# EAGLE design afb_r005_revc (EAGLE 9.6.2)
AUTHOR: Wes B; REV: 3R1

## Sheet 1 of 2
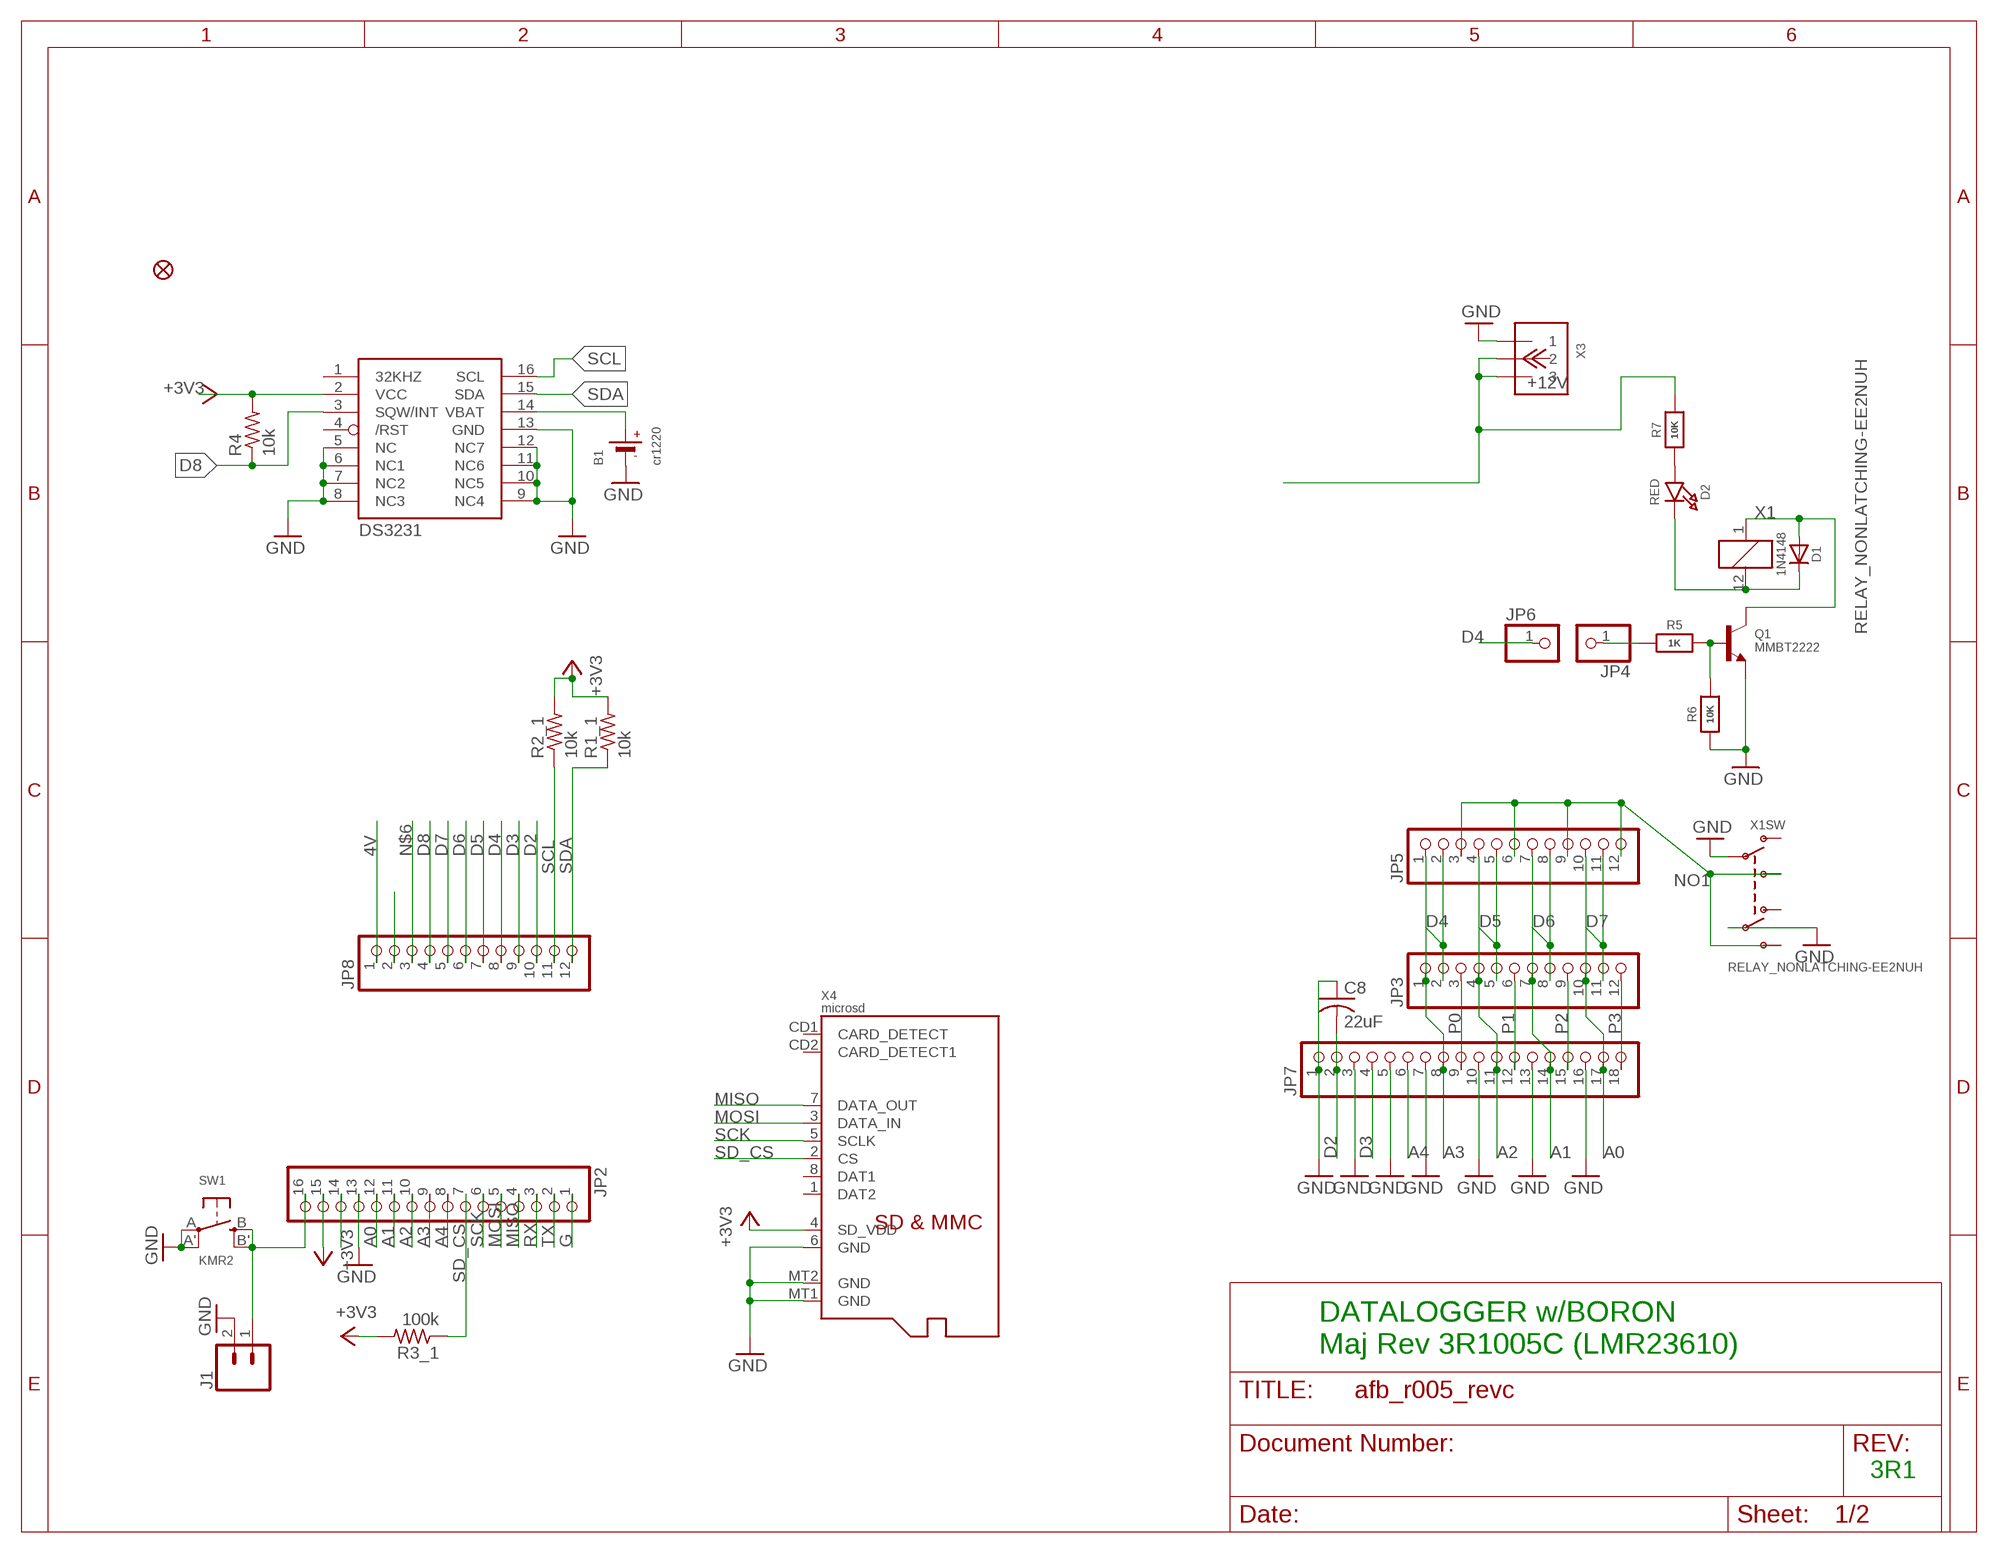
[diagram p0: schematic, sheet 1]

### Parts
B1  cr1220  BATTERYCR1220_2  [CR1220-2]
C8  22uF  C-USC0805  [C0805]
D1  1N4148  DIODESOD-323  [SOD-323]
D2  RED  LED0805_NOOUTLINE  [CHIPLED_0805_NOOUTLINE]
FID1  FIDUCIAL_1MM  [FIDUCIAL_1MM]
IC2  DS3231/SO  [SO16W]
J1  CONN_02  [1X02]
JP2  HEADER-1X16ROUND  [1X16_ROUND]
JP3  PINHD-1X12-CB  [1X12-CB]
JP4  HEADER-1X1ROUND  [1X01_ROUND]
JP5  PINHD-1X12-CB  [1X12-CB]
JP6  HEADER-1X1ROUND  [1X01_ROUND]
JP7  PINHD-1X18  [1X18]
JP8  PINHD-1X12-CB  [1X12-CB]
Q1  MMBT2222  TRANSISTOR_NPN  [SOT23-R]
R1_1  10k  R-US_R0805  [R0805]
R2_1  10k  R-US_R0805  [R0805]
R3_1  100k  R-US_R0805  [R0805]
R4  10k  R-US_R0805  [R0805]
R5  1K  RESISTOR0805_NOOUTLINE  [0805-NO]
R6  10K  RESISTOR0805_NOOUTLINE  [0805-NO]
R7  10K  RESISTOR0805_NOOUTLINE  [0805-NO]
SW1  KMR2  SWITCH_TACT_SMT4.6X2.8  [BTN_KMR2_4.6X2.8]
X1  RELAY_NONLATCHING-EE2NUH  [RELAY_EE2_NOLATCH]
X3  TERMBLOCK_1X3  [TERMBLOCK_1X3-3.5MM]
X4  microsd  MICROSD  [MICROSD]

### Nets
4V: JP8.1 ; also sheet 2
+3V3: IC2.2(VCC) JP2.15 R1_1.2 R2_1.2 R3_1.2 R4.2 X4.4(SD_VDD)
A0: JP2.12 JP3.10 JP5.10 JP7.17
A1: JP2.11 JP3.7 JP5.7 JP7.14
A2: JP2.10 JP3.4 JP5.4 JP7.11
A3: JP2.9 JP3.1 JP5.1 JP7.8
A4: JP2.8 JP7.6
AREF: JP2.14
D2: C8.2 JP7.2 JP8.10
D3: JP7.4 JP8.9
D4: JP3.2 JP5.2 JP6.1 JP8.8
D5: JP3.5 JP5.5 JP8.7
D6: JP3.8 JP5.8 JP8.6
D7: JP3.11 JP5.11 JP8.5
D8: IC2.3(SQW/INT) JP8.4 R4.1
G: JP2.1
GND: B1.- C8.1 IC2.5(NC) IC2.6(NC1) IC2.7(NC2) IC2.8(NC3) IC2.9(NC4) IC2.10(NC5) IC2.11(NC6) IC2.12(NC7) IC2.13(GND) J1.2 JP2.13 JP7.1 JP7.3 JP7.5 JP7.7 JP7.10 JP7.13 JP7.16 Q1.2(E) R6.1 SW1.A'(P1) SW1.A(P) X1.4(SW:P2) X1.9(SW:P1) X3.1 X4.6(GND) X4.MT1(GND) X4.MT2(GND) ; also sheet 2
MISO: JP2.4 X4.7(DATA_OUT)
MOSI: JP2.5 X4.3(DATA_IN)
N$1: B1.+ IC2.14(VBAT)
N$2: D1.A Q1.3(C) X1.1
N$6: JP8.3
N$7: JP8.2
N$11: D1.C D2.C X1.12
N$22: Q1.1(B) R5.2 R6.2
N$24: JP4.1 R5.1
N$26: D2.A R7.1
NO1 [HV]: JP5.3 JP5.6 JP5.9 JP5.12 X1.5(SW:S2) X1.8(SW:S1)
P0: JP3.3 JP7.9
P1: JP3.6 JP7.12
P2: JP3.9 JP7.15
P3: JP3.12 JP7.18
RESET: J1.1 JP2.16 SW1.B'(S1) SW1.B(S)
RX: JP2.3
SCK: JP2.6 X4.5(SCLK)
SCL: IC2.16(SCL) JP8.11 R2_1.1
SD_CS: JP2.7 R3_1.1 X4.2(CS)
SDA: IC2.15(SDA) JP8.12 R1_1.1
TX: JP2.2
VIN: R7.2 X3.2 X3.3 ; also sheet 2
Unconnected: IC2.1(32KHZ) IC2.4(/RST) X1.3(SW:O2) X1.10(SW:O1) X4.1(DAT2) X4.8(DAT1) X4.CD1(CARD_DETECT) X4.CD2(CARD_DETECT1)

### Notes on the sheet
- DATALOGGER w/BORON
  Maj Rev 3R1005C (LMR23610)
- 3R1

## Sheet 2 of 2
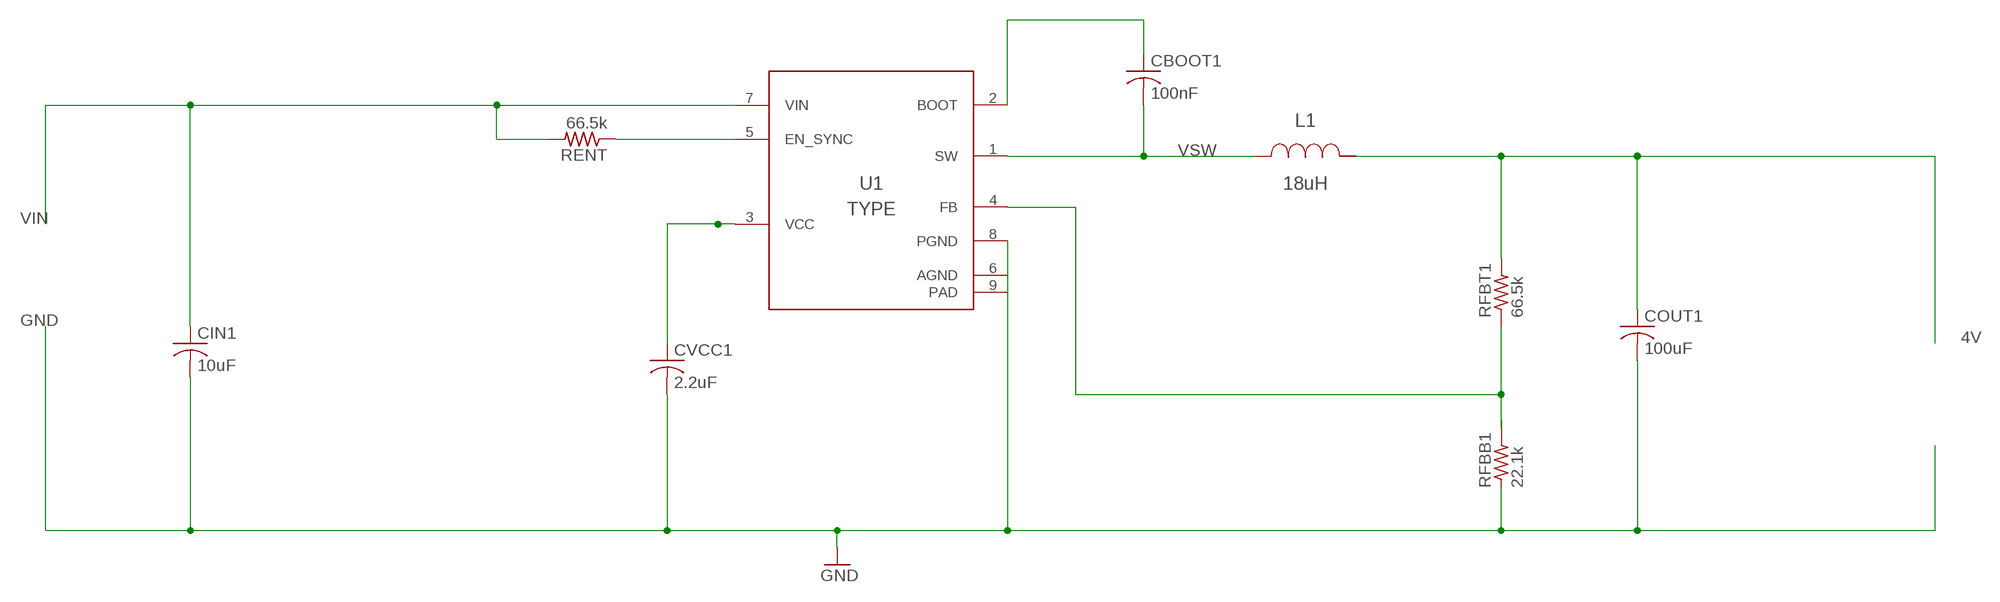
[diagram p1: schematic, sheet 2]

### Parts
CBOOT1  100nF  C-USC0805  [C0805]
CIN1  10uF  C-USC0805  [C0805]
COUT1  100uF  C-USC3216  [C3216]
CVCC1  2.2uF  C-USC0805  [C0805]
L1  18uH  NPI54C180MTRF  [IND_NPI54C]
RENT  66.5k  R-US_R0805  [R0805]
RFBB1  22.1k  R-US_R0805  [R0805]
RFBT1  66.5k  R-US_R0805  [R0805]
U1  Value  LMR23610ADDAR  [DDA0008E_N]

### Nets
3: CVCC1.1 U1.3(VCC)
4: CBOOT1.1 U1.2(BOOT)
4V: COUT1.1 L1.2 RFBT1.2 ; also sheet 1
FB: RFBB1.2 RFBT1.1 U1.4(FB)
GND: CIN1.2 COUT1.2 CVCC1.2 RFBB1.1 U1.6(AGND) U1.8(PGND) U1.9(PAD) ; also sheet 1
N$5: RENT.1 U1.5(EN_SYNC)
VIN: CIN1.1 RENT.2 U1.7(VIN) ; also sheet 1
VSW: CBOOT1.2 L1.1 U1.1(SW)

## Library data of the parts
B1 = microbuilder:BATTERY: CR1220 SMT - Digikey: 3001K-ND CD2032 BAT-HLD-001 - Digikey: BAT-HLD-001-ND
C8 CBOOT1 CIN1 COUT1 CVCC1 = adafruit:C-US: CAPACITOR, American symbol
D1 = microbuilder:DIODE: Diode SMA Model Volts Amps Type Vf Ir Digikey # Notes SSA34-E3 40V 3A Schottky 480mV @ 3A 200uA @ 40V SSA34-E3/61TGITR-ND CDBA120-G 20V 1A Schottky 500mV @ 1A 500uA @ 20V 641-1014-6-ND REEL MBRA210 10V 2A Schottky 350mV @ 2A 700uA @ 10V MBRA210LT3 SOD-123 Model Volts Amps Type Vf Ir Order # Notes BAT54T1G 30V 200mA Schottky 800mV @ 200mA 2uA @ 25V BAT54T1GOSTR-ND B0530W 30V 500mA Schottky 430mV @ 500mA 130uA @ 30V B0530W-FDICT-ND REEL MBR120 20V 1A Schottky 340mV @ 1A MBR120VLSFT1GOSCT-ND SOD-323 Model Volts Amps Type Vf Ir Order # Notes PMEG2005EJ 20V 500mA Schottky 355mV @ 500mA 568-4110-1-ND ZLLS410 10V 570mA Schottky 380mV @ 570mA ZLLS410CT-ND 1N4148WS 75V 150mA Silicon/Simple 1V 1N4148WSFSCT-ND REEL SOD-523 Model Volts Amps Type Vf Ir Order # Notes BAT54XV2 30V 200mA Schottky 0.8V @ 100mA BAT54XV2CT-ND TB751S 30V 30mA Schottky RB751S-40TE61CT-ND SOT23-R/W (R = Solder Paste/Reflow Ovens, W = Hand-Soldering) Model Volts Amps Type Vf Ir Order # Notes BAT54FILM 40V 300mA Schottky 497-7162-1-ND POWERDI-5 Model Volts Amps Type Vf Ir Order # Notes PDS560 60V 5A Schottky 670mV @ 5A 150uA @ 60V PDS560DICT-ND
D2 = microbuilder:LED: LED 0603 - 0603 Surface Mount Package 2mA: Green LED - Low Power (3.9mcd, 2ma, 1.7Vf) - Digikey: 475-2709-2-ND Orange LED - Low Power (9.8mcd, 2ma, 1.8Vf) - Digikey: 475-1194-2-ND Red LED - Low Power (5mcd, 2ma, 1.8Vf) - Digikey: 475-1195-2-ND Yellow LED - Low Power (7mcd, 2ma, 1.8Vf) - Digikey: 475-1196-2-ND 5mA: Blue LED - Low Power (17mcd, 5ma, 2.9Vf) - Digikey: LNJ937W8CRACT-ND 0805 - 0805 Surface Mount Package 2mA: Red LED (8.8mcd, 2mA, 1.8Vf, Clear) - Low Power [Digikey: 475-2510-1-ND] Green LED (5mcd, 2mA, 1.8Vf, Clear) - Low Power [Digikey: 475-2730-1-ND] Yellow LED (11.3mcd, 2mA, 1.8Vf, Clear) - Low Power [Digikey: 475-2555-1-ND] 20mA: Red LED (104mcd, 20mA, Diffused) - LS R976 [Digikey: 475-1278-6-ND] Red LED (12mcd, 20mA, 2.0Vf, Clear) - APT2012EC [Digikey: 754-1128-1-ND] Green LED (15mcd, 20mA, 2.2Vf, Clear) - APT2012GC [Digikey: 754-1131-1-ND] Orange LED (160mcd, 20mA, 2.1Vf, Clear) - APT2012SECK [Digikey: 754-1130-1-ND] 1206 - 1206 Surface Mount Package Green LED (26mcd, 20mA, Diffused) - LG N971 [Digikey: 475-1407-6-ND] Red LED (15mcd, 20mA, Diffused) - LH N974 [Digikey: 475-1416-6-ND] Cree - Cree High-Power Surface Mount LEDs XPEBWT-L1-0000-00D50 - White 111lm 350mA 2.9Vf 6200K 110° XTEAWT-00-0000-00000LEE3 - White 114lm 350mA 2.85Vf 5000K 115° Everlight - Everlight 45-21 Series Surface Mount LEDs 45-21/QK2C-B2832AC2CB2/2T - Warm White 2000mcd 20mA 3.25Vf 3050K 120° 45-21/LK2C-B38452C4CB2/2T - Nuetral White 2000mcd 20mA 3.25Vf 4150K 120° 45-21/LK2C-B50634C6CB2/2T - Cold White 2200mcd 20mA 3.25Vf 5650K 120° PLCC2 Reverse Mount LS T77K-J1L2-1-0-2-R18-Z - Red 11.25mcd 2mA 1.8Vf 630nm 120° LO T77K-L1M2-24-Z - Orange 19.6mcd 2mA 1.8Vf 606nm 120° LY T77K-K2M1-26-Z - Yellow 15.7mcd 2mA 1.8Vf 587nm 120°
FID1 = microbuilder:FIDUCIAL: Fiducial Alignment Points Various fiducial points for machine vision alignment.; BOM: EXCLUDE
IC2 = DS3231:DS3231; AVAILABILITY: Unavailable; DESCRIPTION: Real Time Clock (RTC) IC Clock/Calendar I²C, 2-Wire Serial 16-SOIC (0.295, 7.50mm Width); MF: Maxim Integrated; MP: DS3231; PACKAGE: SOIC-16 Maxim Integrated; PRICE: None
J1 = SparkFun-Connectors:CONN_02: Multi connection point. Often used as Generic Header-pin footprint for 0.1 inch spaced/style header connections On any of the 0.1 inch spaced packages, you can populate with these: Break Away Headers - Straight <https://www.sparkfun.com/products/116> (PRT-00116) Break Away Male Headers - Right Angle <https://www.sparkfun.com/products/553> (PRT-00553) Female Headers <https://www.sparkfun.com/products/115> (PRT-00115) Break Away Headers - Machine Pin <https://www.sparkfun.com/products/117> (PRT-00117) Break Away Female Headers - Swiss Machine Pin <https://www.sparkfun.com/products/743> (PRT-00743) For SCREWTERMINALS and SPRING TERMINALS visit here: Screw Terimnals on SparkFun.com <https://www.sparkfun.com/search/results?term=Screw+Terminals> (5mm/3.5mm/2.54mm spacing) This device is also useful as a general connection point to wire up your design to another part of your project. Our various solder wires solder well into these plated through hole pads. Hook-Up Wire - Assortment (Stranded, 22 AWG) <https://www.sparkfun.com/products/11375> (PRT-11375) Hook-Up Wire - Assortment (Solid Core, 22 AWG) <https://www.sparkfun.com/products/11367> (PRT-11367) View the entire wire category on our website here <https://www.sparkfun.com/categories/141> Special notes: Molex polarized connector foot print use with: PRT-08233 with associated crimp pins and housings. 2.54_SCREWTERM for use with PRT-10571. 3.5mm Screw Terminal footprints for PRT-08084 5mm Screw Terminal footprints for use with PRT-08432
JP2 = microbuilder:HEADER-1X16: PIN HEADER
JP3 JP5 JP8 = adafruit:PINHD-1X12: PIN HEADER
JP4 JP6 = microbuilder:HEADER-1X1: PIN HEADER
JP7 = adafruit:PINHD-1X18: PIN HEADER
L1 = AcceleratedDesigns_Lib:NPI54C180MTRF; DCR: 0.15; IDC: 1.4; L: 1.8E5; MANUFACTURER_NAME: NIC Components; MANUFACTURER_PART_NUMBER: NPI54C180MTRF; VENDOR: NIC Components
Q1 = microbuilder:TRANSISTOR_NPN: NPN Transistor Transistor (NPN) 500mA 45V - BC817 [Digikey: 568-1631-1-ND] Transistor (NPN) 500mA 45V - BC817,215 [Mouser: 771-BC817-T/R] SOT23-R - SOT23 footprint optimised for use with solder paste and reflow ovens. SOT23-W - SOT23 footprint optimised for hand-soldering (larger pads).
R1_1 R2_1 R3_1 R4 RENT RFBB1 RFBT1 = adafruit:R-US_: RESISTOR, American symbol
R5-R7 = microbuilder:RESISTOR: Resistors For new designs, use the packages preceded by an '_' character since they are more reliable: The following footprints should be used on most boards: _0402 - Standard footprint for regular board layouts _0603 - Standard footprint for regular board layouts _0805 - Standard footprint for regular board layouts _1206 - Standard footprint for regular board layouts For extremely tight-pitch boards where space is at a premium, the following 'micro-pitch' footprints can be used (smaller pads, no silkscreen outline, etc.): _0402MP - Micro-pitch footprint for very dense/compact boards _0603MP - Micro-pitch footprint for very dense/compact boards _0805MP - Micro-pitch footprint for very dense/compact boards _1206MP - Micro-pitch footprint for very dense/compact boards
SW1 = microbuilder:SWITCH_TACT_SMT: SMT Tact Switches 6x6mm - Digikey: P12940SCT-ND KMR2 (4.6x2.8mm) - Digikey: 401-1426-1-ND EVQ-PQHB55 - Light Touch, 160GF (4.5x4.5mm) - Digikey: P8090SCT-ND KMT0 - KMT021 NGJ LHS (etc.) IP68/Waterproof - Digikey: CKN10289CT-ND
U1 = AcceleratedDesigns_Lib:LMR23610ADDAR; MANUFACTURER: Texas Instruments; MANUFACTURER_NAME: Texas Instruments; MANUFACTURER_PART_NUMBER: LMR23610ADDAR; PARTNUMBER: LMR23610ADDAR; REFDES: RefDes; TYPE: TYPE
X1 = microbuilder:RELAY_NONLATCHING
X3 = microbuilder:TERMBLOCK_1X3: 3.5mm Terminal block http://www.ladyada.net/library/pcb/eaglelibrary.html
X4 = microbuilder:MICROSD: MicroSD/Transflash Card Holder with SPI pinout 3M: 2908-05WB-MG 4UConnector: 19656 Footprint courtesy: Adafruit Industries

## Net classes
1 HV: width 0.406 mm, drill 0.381 mm, clearance 1.016 mm

## Board
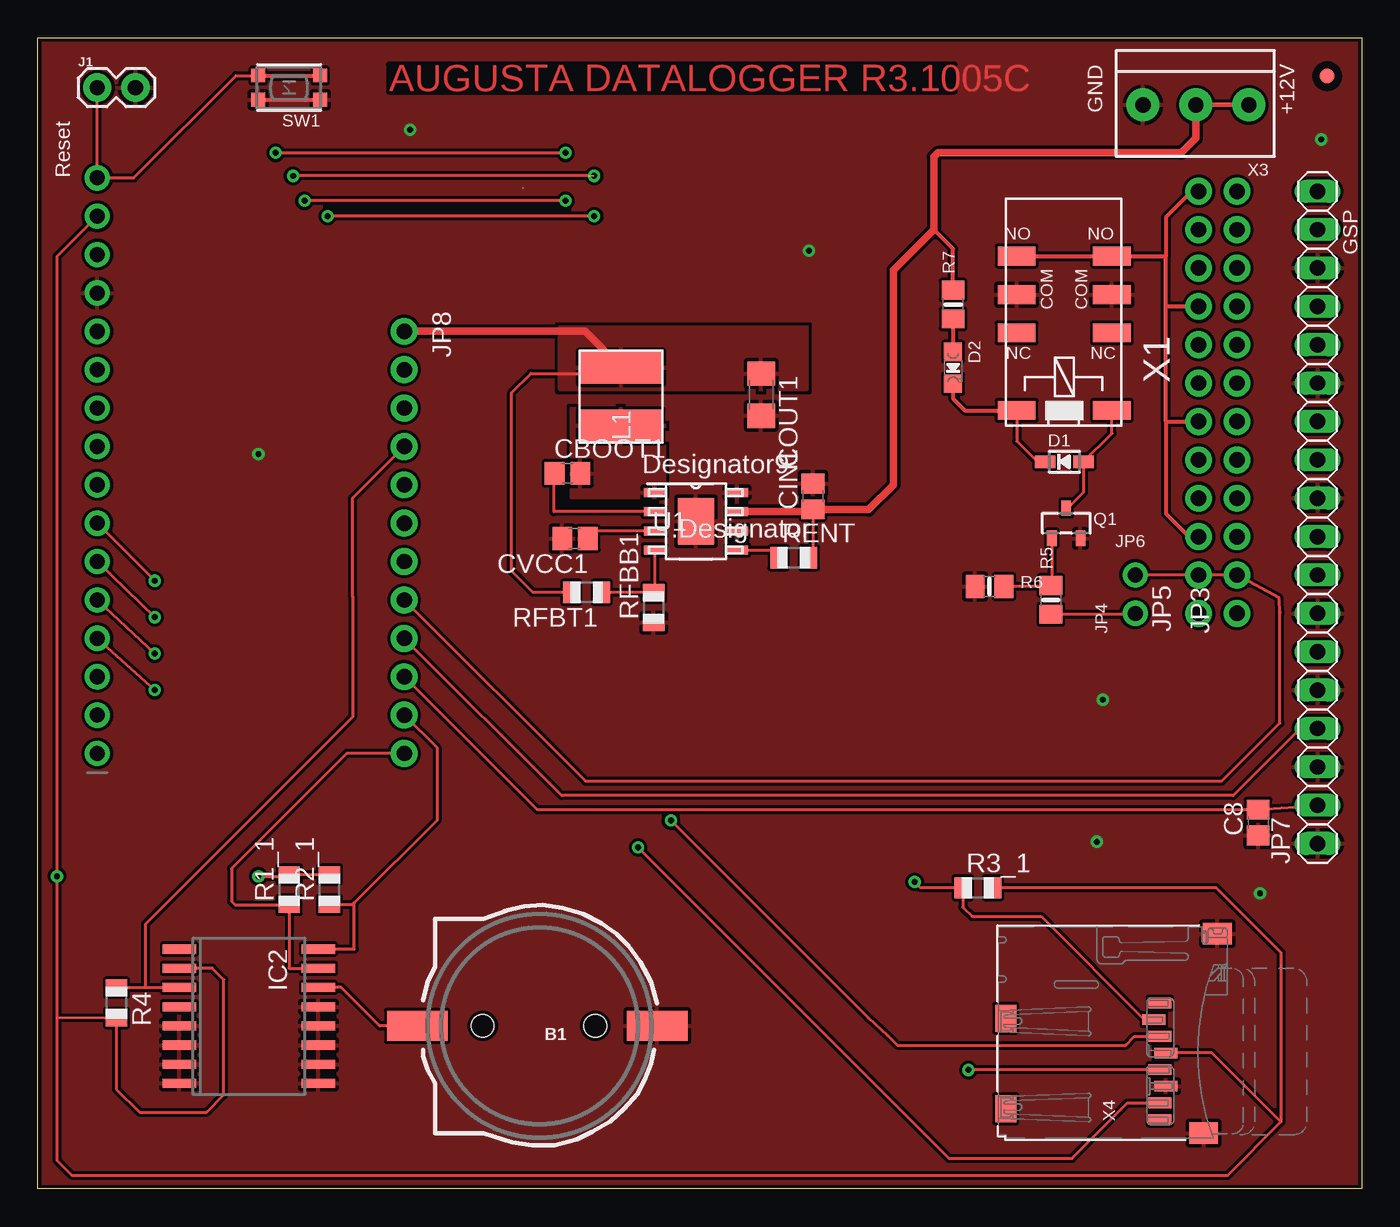
[diagram p2: board, top side]
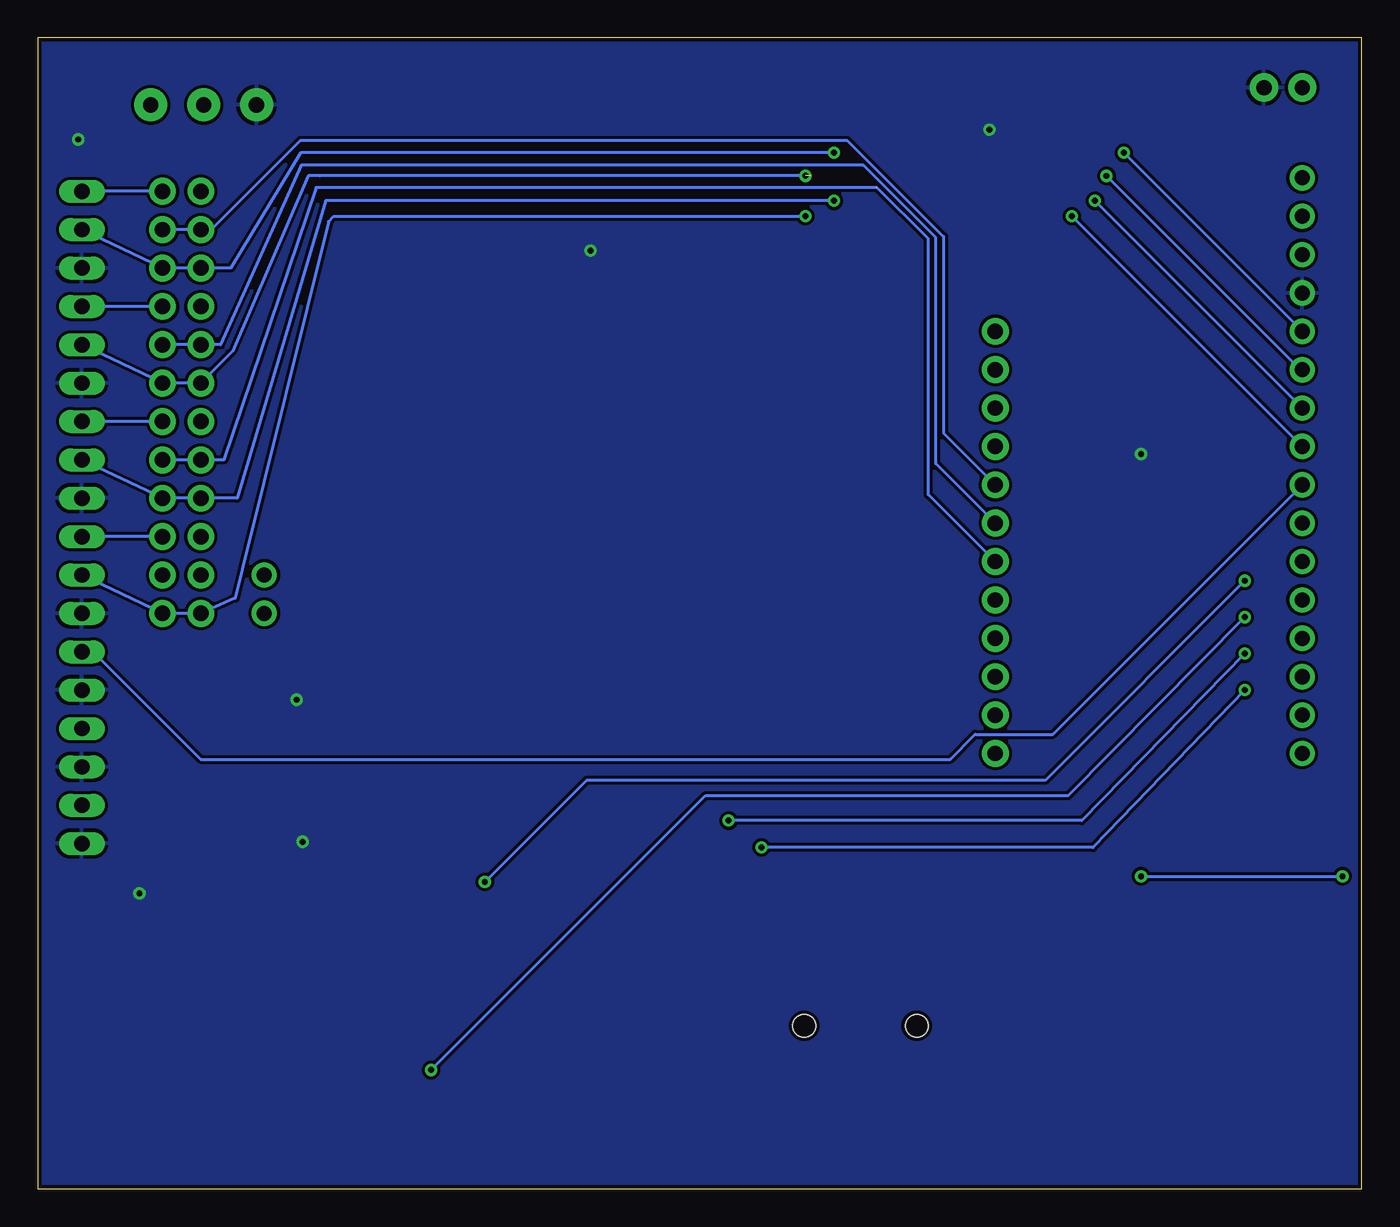
[diagram p3: board, bottom side, seen from below]

Size 87.63 x 76.2 mm. Coordinates in mm from the lower left corner, seen from the top.
Outline: 0,76.2 87.63,76.2 87.63,0 0,0 0,76.2
Copper layers (1*16): Top 0.035mm / dielectric 1.5mm / Bottom 0.035mm
Design rules "adafruit *": minimum track width 8mil, minimum drill 15.5mil, track to track 8mil, track to pad 8mil, pad to pad 8mil, via to via 8mil, smd to smd 8mil, copper to edge 10mil, drill to drill 8mil, minimum pad ring 10mil, minimum via ring 8mil, stop-mask expansion 2mil, vias tented up to drill 20mil, thermal gap 10mil

### Footprints (pad centres in the part's own frame; a part is rotated, then mirrored left to right if it is on the bottom)
CR1220-2 = smd 4 x 2: + 8.29,0; - -7.6,0 | hole 1.5: 3.95,0; -3.5,0
C0805 = smd 1.3 x 1.5: 1 -0.85,0; 2 0.85,0
C3216 = smd 1.6 x 1.8: 1 -1.4,0; 2 1.4,0
SOD-323 = smd 1.35 x 0.8: A 1.27,0; C -1.27,0
CHIPLED_0805_NOOUTLINE = smd 1.2 x 1.2: A 0,-1.05; C 0,1.05
FIDUCIAL_1MM = smd 1 x 1: 1 0,0
SO16W = smd 0.6 x 2.2: 1 -4.445,-4.6; 2 -3.175,-4.6; 3 -1.905,-4.6; 4 -0.635,-4.6; 5 0.635,-4.6; 6 1.905,-4.6; 7 3.175,-4.6; 8 4.445,-4.6; 9 4.445,4.6; 10 3.175,4.6; 11 1.905,4.6; 12 0.635,4.6; 13 -0.635,4.6; 14 -1.905,4.6; 15 -3.175,4.6; 16 -4.445,4.6
1X02 = drill 1.016 pad 1.88: 1 0,0; 2 2.54,0
1X16_ROUND = drill 1 pad 1.676: 1 -19.05,0; 2 -16.51,0; 3 -13.97,0; 4 -11.43,0; 5 -8.89,0; 6 -6.35,0; 7 -3.81,0; 8 -1.27,0; 9 1.27,0; 10 3.81,0; 11 6.35,0; 12 8.89,0; 13 11.43,0; 14 13.97,0; 15 16.51,0; 16 19.05,0
1X12-CB = drill 1.016 pad 1.778: 1 -13.97,0; 2 -11.43,0; 3 -8.89,0; 4 -6.35,0; 5 -3.81,0; 6 -1.27,0; 7 1.27,0; 8 3.81,0; 9 6.35,0; 10 8.89,0; 11 11.43,0; 12 13.97,0
1X01_ROUND = drill 1 pad 1.676: 1 0,0
1X18 = drill 1.016 long: 1 -21.59,0; 2 -19.05,0; 3 -16.51,0; 4 -13.97,0; 5 -11.43,0; 6 -8.89,0; 7 -6.35,0; 8 -3.81,0; 9 -1.27,0; 10 1.27,0; 11 3.81,0; 12 6.35,0; 13 8.89,0; 14 11.43,0; 15 13.97,0; 16 16.51,0; 17 19.05,0; 18 21.59,0
IND_NPI54C = smd 2.146 x 5.512: 1 -1.924,0; 2 1.924,0
SOT23-R = smd 0.635 x 1.016: 1 -0.95,-1; 2 0.95,-1; 3 0,1
R0805 = smd 1.1 x 1.4: 1 -1,0; 2 1,0
0805-NO = smd 1.24 x 1.5: 1 -0.95,0; 2 0.95,0
BTN_KMR2_4.6X2.8 = smd 0.9 x 0.9: A 2.05,0.8; A' -2.05,0.8; B 2.05,-0.8; B' -2.05,-0.8
DDA0008E_N = smd 1.45 x 0.6: 1 -2.725,1.905; 2 -2.725,0.635; 3 -2.725,-0.635; 4 -2.725,-1.905; 5 2.725,-1.905; 6 2.725,-0.635; 7 2.725,0.635; 8 2.725,1.905 | smd 2.4 x 3.1: 9 0,0
RELAY_EE2_NOLATCH = smd 1.25 x 2.5: 1 -6.5,-3.15; 3 -1.37,-3.15; 4 1.17,-3.15; 5 3.71,-3.15; 8 3.71,3.15; 9 1.17,3.15; 10 -1.37,3.15; 12 -6.5,3.15
TERMBLOCK_1X3-3.5MM = drill 1 pad 2.184: 1 3.55,0; 2 0.05,0; 3 -3.45,0
MICROSD = smd 0.7 x 1.5: 1 9,-10.64; 2 7.9,-10.24; 3 6.8,-10.64; 4 5.7,-11.04; 5 4.6,-10.64; 6 3.5,-11.04; 7 2.4,-10.64; 8 1.3,-10.64 | smd 1.8 x 1.4: CD1 2,-0.44; CD2 8,-0.44 | smd 1.4 x 1.9: MT1 0.4,-13.54; MT2 13.6,-14.44

### Placement (x,y rotation side)
B1  33.4,10.79 180 top
C8  80.77,24.26 90 top
CBOOT1  35.05,47.37 0 top
CIN1  51.31,45.85 90 top
COUT1  47.88,52.58 270 top
CVCC1  35.56,43.05 180 top
D1  67.94,48.13 0 top
D2  60.58,54.36 180 top
FID1  85.34,73.66 0 top
IC2  13.97,11.43 270 top
J1  3.94,72.9 0 top
JP2  3.94,47.88 90 top
JP3  79.38,52.07 90 top
JP4  72.64,38.1 90 top
JP5  76.83,52.07 90 top
JP6  72.64,40.64 0 top
JP7  84.71,44.45 90 top
JP8  24.26,42.8 270 top
L1  38.61,52.45 90 top
Q1  68.07,44.07 0 top
R1_1  16.64,19.81 90 top
R2_1  19.3,19.81 90 top
R3_1  62.23,19.94 0 top
R4  5.21,12.32 270 top
R5  67.06,38.99 90 top
R6  62.99,39.88 0 top
R7  60.58,58.55 90 top
RENT  50.04,41.78 0 top
RFBB1  40.77,38.48 90 top
RFBT1  36.32,39.5 180 top
SW1  16.64,72.9 180 top
U1  43.56,44.2 0 top
X1  67.94,58.04 90 top
X3  76.71,71.75 180 top
X4  63.63,3.3 90 top

### Tracks (layer width: path | path; a pad name or v marks a point on that pad's centre or on a via)
3
  Top 0.203: U1.3 36.92,43.56 CVCC1.1
4
  Top 0.203: U1.2 34.16,44.83 34.16,47.37 CBOOT1.1
4V
  Top 0.203: RFBT1.2 32.77,39.5 31.37,40.89 31.37,52.7 32.64,53.98 38.21,53.98 L1.2
  Top 0.508: JP8.1 36.21,56.77 L1.2
  pour Top (isolate 0.406): 34.54,52.96 50.93,52.96 50.93,57.02 34.54,57.02
+3V3  (via drill 0.39)
  Top 0.203: 1.27,11.3 v1.27,20.7 1.27,61.72 JP2.15 | 1.27,11.3 1.27,1.91 2.29,0.89 78.74,0.89 82.28,4.43 | X4.4 77.72,9 82.28,4.43 | 82.28,4.43 82.28,15.65 78,19.94 R3_1.2 | 1.27,11.3 R4.2 5.21,6.6 6.73,5.08 11.18,5.08 12.32,6.22 12.32,13.84 11.56,14.61 IC2.2 | v14.61,20.7 16.53,20.7 R1_1.2 R2_1.2
  Bottom 0.203: v14.61,20.7 v1.27,20.7
A0  (via drill 0.39)
  Top 0.203: v15.75,68.58 v34.92,68.58
  Bottom 0.203: JP7.17 JP3.10 JP5.10 74.85,60.96 70.23,68.58 v34.92,68.58 | JP2.12 v15.75,68.58
A1  (via drill 0.39)  (2 unrouted)
  Top 0.203: 36.45,67.06 v16.89,67.06
  Bottom 0.203: JP7.14 JP3.7 JP5.7 74.73,55.44 69.72,67.06 68.96,67.06 | v16.89,67.06 4.06,54.23 JP2.11 | v36.83,67.06 68.96,67.06 | 68.96,67.06
A2  (via drill 0.39)
  Top 0.203: v34.92,65.41 v17.65,65.41
  Bottom 0.203: v34.92,65.41 68.58,65.41 74.45,45.72 JP5.4 JP3.4 JP7.11 | JP2.10 v17.65,65.41
A3  (via drill 0.39)
  Top 0.203: v36.83,64.39 v19.18,64.39
  Bottom 0.203: JP2.9 v19.18,64.39 | JP7.8 JP3.1 JP5.1 74.55,39.12 74.09,41.01 68.39,64.04 68.04,64.39 v36.83,64.39
A4
  Bottom 0.203: JP7.6 83.95,35.56 76.83,28.45 27.24,28.45 25.59,30.1 20.45,30.1 JP2.8
D2
  Top 0.203: JP7.2 C8.2 33.06,25.11 JP8.10
D3
  Top 0.203: JP8.9 34.67,26.04 79.12,26.04 83.57,30.48 JP7.4
D4
  Top 0.203: 82.22,38.09 82.21,38.2 | 82.22,38.09 82.22,30.82 82.19,30.82 78.36,27 36.25,27 JP8.8 | 82.22,38.09 82.17,39.12 JP3.2 JP5.2 JP6.1
D5  (1 unrouted)
  Bottom 0.203: JP3.5 JP5.5 75.32,48.26 69.22,66.29 32.13,66.29 | JP8.7 28.69,45.97 28.69,62.9 32.09,66.29
D6
  Bottom 0.203: JP3.8 JP5.8 75.53,55.88 75.53,55.91 70.2,67.76 32.98,67.76 28.19,62.97 28.19,48 JP8.6
D7
  Bottom 0.203: JP3.11 JP5.11 76.15,63.5 70.24,69.41 34.06,69.41 27.68,63.04 27.68,50.04 JP8.5
D8
  Top 0.203: 9.35,13.35 IC2.3 7.11,13.34 | 7.11,13.34 5.21,13.34 R4.1 | JP8.4 20.83,45.72 20.83,39.24 20.83,31.24 7.11,17.53 7.11,13.34
FB
  Top 0.203: U1.4 40.84,39.55 RFBB1.2 37.34,39.48 RFBT1.1
GND  (via drill 0.39)
  Top 0.254: SW1.A SW1.A'
  other vias: 80.9,19.56 70.1,22.99 84.96,69.47 70.48,32.38 24.64,70.1 51.05,62.1 14.61,48.64
  pour Top (rank 3): 0,77.47 0,0 88.01,0 88.01,77.47
  pour Bottom: 0,77.47 0,0 88.14,0 88.14,77.47
MISO  (via drill 0.39)
  Top 0.203: 4.06,36.45 JP2.4 v7.75,33.02 | v39.73,22.61 60.31,2.03 68.45,2.03 72.12,5.7 X4.7
  Bottom 0.203: v39.73,22.61 17.78,22.61 v7.75,33.02
MOSI  (via drill 0.39)
  Top 0.203: 56.2,10.22 54.97,11.32 v41.9,24.38 | 56.2,10.22 56.26,10.16 | 56.2,10.22 56.89,9.53 72.01,9.53 72.59,10.1 X4.3 | JP2.5 v7.75,35.43
  Bottom 0.203: v7.75,35.43 18.54,24.38 v41.9,24.38
N$1
  Top 0.203: B1.+ 22.63,10.79 20.09,13.34 IC2.14
N$2
  Top 0.203: X1.1 71.09,50.01 D1.A 69.22,46.1 68.18,45.07 Q1.3
N$5
  Top 0.203: U1.5 48.53,42.29 RENT.1
N$11
  Top 0.203: X1.12 64.8,49.51 66.17,48.13 D1.C
  Top 0.254: D2.C 60.58,52.32 61.36,51.54 X1.12
N$22
  Top 0.203: Q1.1 67.12,40.01 R5.2 67,39.88 R6.2
N$24
  Top 0.203: JP4.1 72.58,38.04 R5.1
N$26
  Top 0.254: R7.1 D2.A
NO1
  Top 0.254: X1.8 X1.5 74.68,61.75 | 74.68,50.8 74.68,58.42 | 74.68,50.8 JP5.6 | 74.68,50.8 74.68,44.7 76.2,43.18 JP5.3 | 76.39,66.04 74.68,64.32 74.68,61.75 | 74.68,58.42 74.68,61.75 | JP5.9 74.68,58.42
  Top 0.406: JP5.12 76.39,66.04
P0
  Bottom 0.203: JP3.3 JP7.9
P1
  Bottom 0.203: JP3.6 JP7.12
P2
  Bottom 0.203: JP3.9 JP7.15
P3
  Bottom 0.203: JP3.12 JP7.18
RESET
  Top 0.203: SW1.B 13.12,73.7 6.35,66.93 JP2.16 J1.1
  Top 0.254: SW1.B SW1.B'
SCK  (via drill 0.39)
  Top 0.203: X4.5 74.24,7.87 v61.59,7.87 | JP2.6 v7.75,37.85
  Bottom 0.203: v7.75,37.85 19.43,26.04 43.43,26.04 v61.59,7.87
SCL
  Top 0.203: JP8.11 26.42,29.21 26.42,24.38 20.95,18.92 | IC2.16 20.95,15.88 20.95,18.92 | 20.95,18.92 20.84,18.81 R2_1.1
SD_CS  (via drill 0.39)
  Top 0.203: JP2.7 v7.75,40.26 | v58.04,20.32 58.42,19.94 R3_1.1 61.23,18.65 61.85,18.03 66.42,18.03 73.28,11.18 73.84,11.18 X4.2
  Bottom 0.203: v7.75,40.26 20.95,27.05 51.31,27.05 v58.04,20.32
SDA
  Top 0.203: JP8.12 20.45,28.83 12.83,21.21 12.83,19.05 13.06,18.81 R1_1.1 16.64,14.61 IC2.15
VIN
  Top 0.203: 51.35,44.96 CIN1.1 | CIN1.1 51.14,44.83 | CIN1.1 51.31,42.05 RENT.2
  Top 0.254: R7.2 60.58,62.23 59.31,63.5
  Top 0.305: X3.3 X3.2
  Top 0.508: X3.2 76.66,69.55 75.69,68.58 59.56,68.58 59.31,68.33 59.31,63.5 58.42,62.61 56.64,60.83 56.64,46.61 54.99,44.96 51.35,44.96 | 51.14,44.83 U1.7
VSW
  pour Top: 41.53,45.72 41.53,51.69 35.31,51.69 35.31,45.72 36.58,45.72

### Text on the board
Top: AUGUSTA DATALOGGER R3.1005C
tPlace: GND | +12V | Reset | GSP